# Altium project op-pcb-mcp23017.PrjPcb
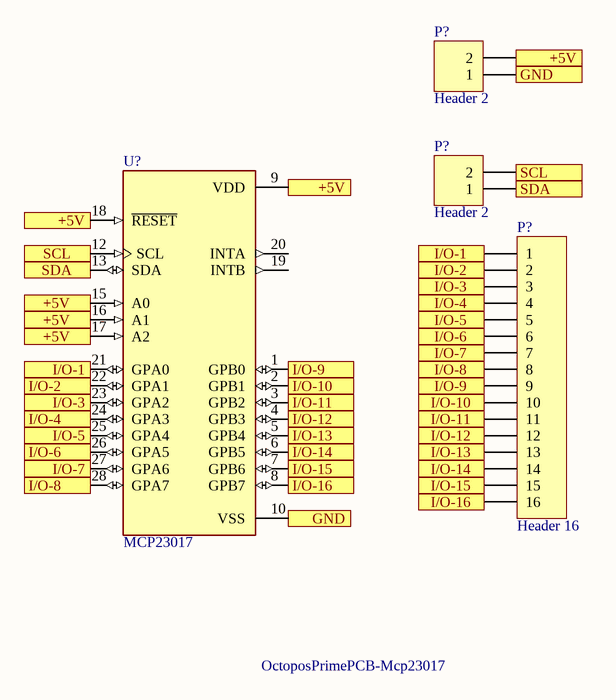
[diagram p0: op-pcb-mcp23017-sch.SchDoc]
1 sheet, 4 parts. Net scope: flat (ports and power ports of the same name join across sheets).
Board file: op-pcb-mcp23017-pcb.PcbDoc

## Sheet op-pcb-mcp23017-sch.SchDoc
size 149 x 149 mm; SheetNumber: 1; SheetTotal: 1

### Parts
(Parts that share a designator on the sheet are numbered #1, #2 ... from top to bottom, then left to right.)
P?#1  Header 2  [HDR1X2]
P?#2  Header 2  [HDR1X2]
P?#3  Header 16  [HDR1X16]
U?  MCP23017  [MCP23017]

### Ports
+5V (in), GND (in), I/O-1 (in), I/O-2 (in), I/O-3 (in), I/O-4 (in), I/O-5 (in), I/O-6 (in), I/O-7 (in), I/O-8 (in), I/O-9 (in), I/O-10 (in), I/O-11 (in), I/O-12 (in), I/O-13 (in), I/O-14 (in), I/O-15 (in), I/O-16 (in), SCL (in), SDA (in)

### Nets
NetP?#1_1: P?#1.1 U?.10(VSS) ; port GND
NetP?#1_2: P?#1.2 U?.9(VDD) U?.15(A0) U?.16(A1) U?.17(A2) U?.18(~{RESET}) ; port +5V
NetP?#2_1: P?#2.1 U?.13(SDA) ; port SDA
NetP?#2_2: P?#2.2 U?.12(SCL) ; port SCL
NetP?#3_1: P?#3.1 U?.21(GPA0) ; port I/O-1
NetP?#3_2: P?#3.2 U?.22(GPA1) ; port I/O-2
NetP?#3_3: P?#3.3 U?.23(GPA2) ; port I/O-3
NetP?#3_4: P?#3.4 U?.24(GPA3) ; port I/O-4
NetP?#3_5: P?#3.5 U?.25(GPA4) ; port I/O-5
NetP?#3_6: P?#3.6 U?.26(GPA5) ; port I/O-6
NetP?#3_7: P?#3.7 U?.27(GPA6) ; port I/O-7
NetP?#3_8: P?#3.8 U?.28(GPA7) ; port I/O-8
NetP?#3_9: P?#3.9 U?.1(GPB0) ; port I/O-9
NetP?#3_10: P?#3.10 U?.2(GPB1) ; port I/O-10
NetP?#3_11: P?#3.11 U?.3(GPB2) ; port I/O-11
NetP?#3_12: P?#3.12 U?.4(GPB3) ; port I/O-12
NetP?#3_13: P?#3.13 U?.5(GPB4) ; port I/O-13
NetP?#3_14: P?#3.14 U?.6(GPB5) ; port I/O-14
NetP?#3_15: P?#3.15 U?.7(GPB6) ; port I/O-15
NetP?#3_16: P?#3.16 U?.8(GPB7) ; port I/O-16

Not connected (* = marked no-connect by the designer): U? 19(INTB) 20(INTA)

### Notes on the sheet
- OctoposPrimePCB-Mcp23017

### Library data of the parts
P?#1 P?#2 = Header 2: Header, 2-Pin; LatestRevisionDate: 17-Jul-2002; LatestRevisionNote: Re-released for DXP Platform.; Publisher: Altium Limited
P?#3 = Header 16: Header, 16-Pin; LatestRevisionDate: 17-Jul-2002; LatestRevisionNote: Re-released for DXP Platform.; Publisher: Altium Limited